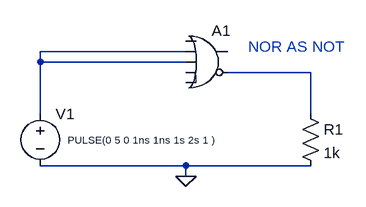
[diagram p0: schematic 206.asc]
206.asc, the LTspice schematic file:
Version 4
SHEET 1 880 680
WIRE 192 96 -32 96
WIRE -32 112 -32 96
WIRE 192 112 -32 112
WIRE 384 128 256 128
WIRE -32 192 -32 112
WIRE 384 192 384 128
WIRE 192 272 -32 272
WIRE 384 272 192 272
WIRE 192 288 192 272
FLAG 192 288 0
SYMBOL Digital\\or 224 48 R0
SYMATTR InstName A1
SYMBOL res 368 176 R0
SYMATTR InstName R1
SYMATTR Value 1k
SYMBOL voltage -32 176 R0
WINDOW 3 42 56 Left 1
SYMATTR InstName V1
SYMATTR Value PULSE(0 5 0 1ns 1ns 1s 2s 1 )
TEXT 288 88 Left 2 ;NOR AS NOT

The netlist it stands for:
* 206.asc
A1 0 N001 N001 0 0 N002 0 0 OR
R1 N002 0 1k
V1 N001 0 PULSE(0 5 0 1ns 1ns 1s 2s 1 )
* NOR AS NOT
.backanno
.end